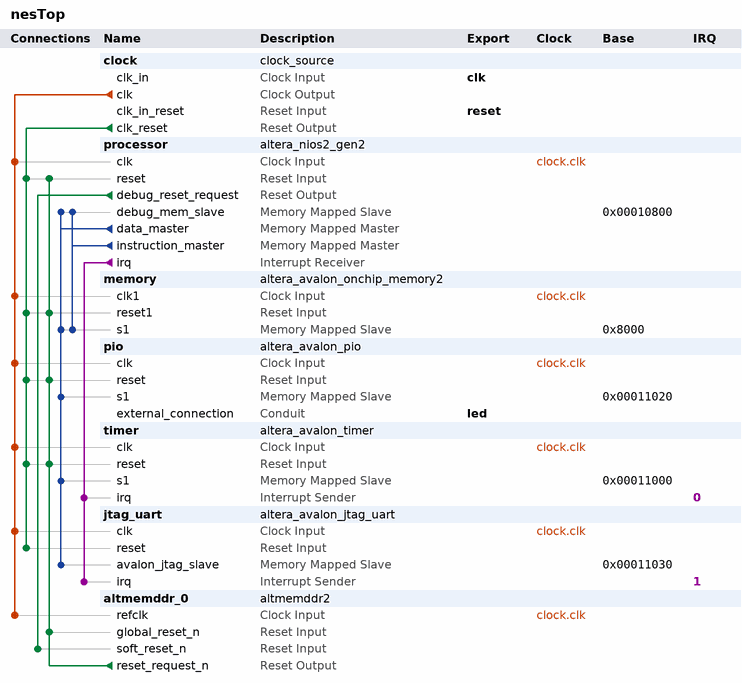
[diagram p0: system contents]
# Platform Designer (Qsys) system nesTop, Cyclone IV E EP4CE22F17C6
# Parameters at their usual value, and those the tool derives, are not listed.
package require -exact qsys 16.1
create_system nesTop
set_project_property DEVICE_FAMILY {Cyclone IV E}
set_project_property DEVICE EP4CE22F17C6

add_instance clock clock_source 16.1
set_instance_parameter_value clock clockFrequency 100000000

add_instance processor altera_nios2_gen2 16.1
set_instance_parameter_value processor dcache_size 2048
set_instance_parameter_value processor exceptionSlave memory.s1
set_instance_parameter_value processor icache_size 4096
set_instance_parameter_value processor impl Tiny
set_instance_parameter_value processor resetSlave memory.s1

add_instance memory altera_avalon_onchip_memory2 16.1
set_instance_parameter_value memory dataWidth 32
set_instance_parameter_value memory dualPort false
set_instance_parameter_value memory initMemContent true
set_instance_parameter_value memory initializationFileName onchip_mem.hex
set_instance_parameter_value memory memorySize 32768

add_instance pio altera_avalon_pio 16.1
set_instance_parameter_value pio direction Output
set_instance_parameter_value pio width 8

add_instance timer altera_avalon_timer 16.1
set_instance_parameter_value timer period 1
set_instance_parameter_value timer periodUnits MSEC

add_instance jtag_uart altera_avalon_jtag_uart 16.1
set_instance_parameter_value jtag_uart simInteractiveOptions NO_INTERACTIVE_WINDOWS

add_instance altmemddr_0 altmemddr2 16.1
set_instance_parameter_value altmemddr_0 WIDTH_RATIO 4
set_instance_parameter_value altmemddr_0 ac_clk_select 90
set_instance_parameter_value altmemddr_0 ac_phase 90
set_instance_parameter_value altmemddr_0 addr_cmd_slew_rate 1.0
set_instance_parameter_value altmemddr_0 auto_powerdn_cycles 0
set_instance_parameter_value altmemddr_0 auto_powerdn_en false
set_instance_parameter_value altmemddr_0 avalon_burst_length 1
set_instance_parameter_value altmemddr_0 board_addresscmd_CK_skew 0.0
set_instance_parameter_value altmemddr_0 board_inter_DQS_group_skew 0.02
set_instance_parameter_value altmemddr_0 board_intra_DQS_group_skew 0.02
set_instance_parameter_value altmemddr_0 board_maxCK_DQS_skew 0.01
set_instance_parameter_value altmemddr_0 board_minCK_DQS_skew -0.01
set_instance_parameter_value altmemddr_0 board_settings_valid true
set_instance_parameter_value altmemddr_0 board_skew_ps 20
set_instance_parameter_value altmemddr_0 board_tpd_inter_DIMM 0.05
set_instance_parameter_value altmemddr_0 burst_merge_en false
set_instance_parameter_value altmemddr_0 cfg_data_reordering_type INTER_BANK
set_instance_parameter_value altmemddr_0 cfg_reorder_data true
set_instance_parameter_value altmemddr_0 cfg_starve_limit 10
set_instance_parameter_value altmemddr_0 chip_or_dimm {Discrete Device}
set_instance_parameter_value altmemddr_0 ck_ckn_slew_rate 2.0
set_instance_parameter_value altmemddr_0 clk_source_sharing_en false
set_instance_parameter_value altmemddr_0 controller_type ngv110_ctl
set_instance_parameter_value altmemddr_0 csr_en false
set_instance_parameter_value altmemddr_0 ctl_auto_correct_en false
set_instance_parameter_value altmemddr_0 ctl_autopch_en false
set_instance_parameter_value altmemddr_0 ctl_dynamic_bank_allocation false
set_instance_parameter_value altmemddr_0 ctl_dynamic_bank_num 4
set_instance_parameter_value altmemddr_0 ctl_ecc_en false
set_instance_parameter_value altmemddr_0 ctl_hrb_en false
set_instance_parameter_value altmemddr_0 ctl_latency 0
set_instance_parameter_value altmemddr_0 ctl_lookahead_depth 4
set_instance_parameter_value altmemddr_0 ctl_powerdn_en false
set_instance_parameter_value altmemddr_0 ctl_self_refresh_en false
set_instance_parameter_value altmemddr_0 debug_en false
set_instance_parameter_value altmemddr_0 dedicated_memory_clk_en false
set_instance_parameter_value altmemddr_0 dedicated_memory_clk_phase 0
set_instance_parameter_value altmemddr_0 dedicated_memory_clk_phase_label {Dedicated memory clock phase:}
set_instance_parameter_value altmemddr_0 dll_external false
set_instance_parameter_value altmemddr_0 dq_slew_rate 1.0
set_instance_parameter_value altmemddr_0 dqs_dqsn_slew_rate 2.0
set_instance_parameter_value altmemddr_0 dss_tinit_rst_us 200.0
set_instance_parameter_value altmemddr_0 enable_mp_calibration true
set_instance_parameter_value altmemddr_0 enable_v72_rsu false
set_instance_parameter_value altmemddr_0 export_bank_info false
set_instance_parameter_value altmemddr_0 export_debug_port false
set_instance_parameter_value altmemddr_0 family {Cyclone IV E}
set_instance_parameter_value altmemddr_0 fast_simulation_en FAST
set_instance_parameter_value altmemddr_0 input_period 0
set_instance_parameter_value altmemddr_0 isi_DQ 0.0
set_instance_parameter_value altmemddr_0 isi_DQS 0.0
set_instance_parameter_value altmemddr_0 isi_addresscmd_hold 0.0
set_instance_parameter_value altmemddr_0 isi_addresscmd_setup 0.0
set_instance_parameter_value altmemddr_0 local_if_clk_mhz_label 200.0
set_instance_parameter_value altmemddr_0 local_if_drate Full
set_instance_parameter_value altmemddr_0 local_if_dwidth_label 16
set_instance_parameter_value altmemddr_0 local_if_type_avalon true
set_instance_parameter_value altmemddr_0 max_local_size 4
set_instance_parameter_value altmemddr_0 mem_addr_mapping CHIP_ROW_BANK_COL
set_instance_parameter_value altmemddr_0 mem_asrm {Manual SR Reference (SRT)}
set_instance_parameter_value altmemddr_0 mem_atcl Disabled
set_instance_parameter_value altmemddr_0 mem_bl 4
set_instance_parameter_value altmemddr_0 mem_btype Sequential
set_instance_parameter_value altmemddr_0 mem_dll_en Yes
set_instance_parameter_value altmemddr_0 mem_dll_pch {Fast Exit}
set_instance_parameter_value altmemddr_0 mem_drv_impedance RZQ/7
set_instance_parameter_value altmemddr_0 mem_drv_str Normal
set_instance_parameter_value altmemddr_0 mem_dyn_deskew_en false
set_instance_parameter_value altmemddr_0 mem_fmax 200.0
set_instance_parameter_value altmemddr_0 mem_if_bankaddr_width 2
set_instance_parameter_value altmemddr_0 mem_if_clk_mhz 200.0
set_instance_parameter_value altmemddr_0 mem_if_clk_pair_count 1
set_instance_parameter_value altmemddr_0 mem_if_clk_ps_label {(5000 ps)}
set_instance_parameter_value altmemddr_0 mem_if_coladdr_width 10
set_instance_parameter_value altmemddr_0 mem_if_cs_per_dimm 1
set_instance_parameter_value altmemddr_0 mem_if_cs_per_rank 1
set_instance_parameter_value altmemddr_0 mem_if_cs_width 1
set_instance_parameter_value altmemddr_0 mem_if_dm_pins_en Yes
set_instance_parameter_value altmemddr_0 mem_if_dq_per_dqs 8
set_instance_parameter_value altmemddr_0 mem_if_dqsn_en false
set_instance_parameter_value altmemddr_0 mem_if_dwidth 8
set_instance_parameter_value altmemddr_0 mem_if_memtype {DDR2 SDRAM}
set_instance_parameter_value altmemddr_0 mem_if_oct_en false
set_instance_parameter_value altmemddr_0 mem_if_pchaddr_bit 10
set_instance_parameter_value altmemddr_0 mem_if_preset {JEDEC DDR2-400 256Mb x8}
set_instance_parameter_value altmemddr_0 mem_if_preset_rlat 0
set_instance_parameter_value altmemddr_0 mem_if_rowaddr_width 13
set_instance_parameter_value altmemddr_0 mem_if_tinit_us 200.0
set_instance_parameter_value altmemddr_0 mem_if_tmrd_ns 10.0
set_instance_parameter_value altmemddr_0 mem_if_tras_ns 40.0
set_instance_parameter_value altmemddr_0 mem_if_trcd_ns 15.0
set_instance_parameter_value altmemddr_0 mem_if_trefi_us 7.0
set_instance_parameter_value altmemddr_0 mem_if_trfc_ns 75.0
set_instance_parameter_value altmemddr_0 mem_if_trp_ns 15.0
set_instance_parameter_value altmemddr_0 mem_if_twr_ns 15.0
set_instance_parameter_value altmemddr_0 mem_if_twtr_ck 2
set_instance_parameter_value altmemddr_0 mem_mpr_loc {Predefined Pattern}
set_instance_parameter_value altmemddr_0 mem_mpr_oper {Predefined Pattern}
set_instance_parameter_value altmemddr_0 mem_odt Disabled
set_instance_parameter_value altmemddr_0 mem_pasr {Full Array}
set_instance_parameter_value altmemddr_0 mem_rtt_nom {ODT Disabled}
set_instance_parameter_value altmemddr_0 mem_rtt_wr {Dynamic ODT off}
set_instance_parameter_value altmemddr_0 mem_srtr Normal
set_instance_parameter_value altmemddr_0 mem_tac_ps 600
set_instance_parameter_value altmemddr_0 mem_tcl 3.0
set_instance_parameter_value altmemddr_0 mem_tcl_100_fmax 400.0
set_instance_parameter_value altmemddr_0 mem_tcl_15_fmax 533.0
set_instance_parameter_value altmemddr_0 mem_tcl_20_fmax 533.0
set_instance_parameter_value altmemddr_0 mem_tcl_25_fmax 533.0
set_instance_parameter_value altmemddr_0 mem_tcl_30_fmax 200.0
set_instance_parameter_value altmemddr_0 mem_tcl_40_fmax 200.0
set_instance_parameter_value altmemddr_0 mem_tcl_50_fmax 200.0
set_instance_parameter_value altmemddr_0 mem_tcl_60_fmax 200.0
set_instance_parameter_value altmemddr_0 mem_tcl_70_fmax 400.0
set_instance_parameter_value altmemddr_0 mem_tcl_80_fmax 400.0
set_instance_parameter_value altmemddr_0 mem_tcl_90_fmax 400.0
set_instance_parameter_value altmemddr_0 mem_tdha_ps 400
set_instance_parameter_value altmemddr_0 mem_tdqsck_ps 500
set_instance_parameter_value altmemddr_0 mem_tdqsq_ps 400
set_instance_parameter_value altmemddr_0 mem_tdqss_ck 0.25
set_instance_parameter_value altmemddr_0 mem_tdsa_ps 400
set_instance_parameter_value altmemddr_0 mem_tdsh_ck 0.2
set_instance_parameter_value altmemddr_0 mem_tdss_ck 0.2
set_instance_parameter_value altmemddr_0 mem_tfaw_ns 37.5
set_instance_parameter_value altmemddr_0 mem_tiha_ps 600
set_instance_parameter_value altmemddr_0 mem_tisa_ps 600
set_instance_parameter_value altmemddr_0 mem_tqh_ck 0.36
set_instance_parameter_value altmemddr_0 mem_tqhs_ps 450
set_instance_parameter_value altmemddr_0 mem_trrd_ns 7.5
set_instance_parameter_value altmemddr_0 mem_trtp_ns 7.5
set_instance_parameter_value altmemddr_0 mem_wtcl 5.0
set_instance_parameter_value altmemddr_0 mirror_addressing 0
set_instance_parameter_value altmemddr_0 mp_DH_percent 0.5
set_instance_parameter_value altmemddr_0 mp_DQSCK_percent 0.5
set_instance_parameter_value altmemddr_0 mp_DQSQ_percent 0.65
set_instance_parameter_value altmemddr_0 mp_DQSS_percent 0.5
set_instance_parameter_value altmemddr_0 mp_DSH_percent 0.6
set_instance_parameter_value altmemddr_0 mp_DSS_percent 0.6
set_instance_parameter_value altmemddr_0 mp_DS_percent 0.6
set_instance_parameter_value altmemddr_0 mp_IH_percent 0.6
set_instance_parameter_value altmemddr_0 mp_IS_percent 0.7
set_instance_parameter_value altmemddr_0 mp_QHS_percent 0.5
set_instance_parameter_value altmemddr_0 mp_QH_percent 0.5
set_instance_parameter_value altmemddr_0 mp_WLH_percent 0.6
set_instance_parameter_value altmemddr_0 mp_WLS_percent 0.7
set_instance_parameter_value altmemddr_0 multicast_wr_en false
set_instance_parameter_value altmemddr_0 new_variant true
set_instance_parameter_value altmemddr_0 num_slots_or_devices 1
set_instance_parameter_value altmemddr_0 phy_if_type_afi true
set_instance_parameter_value altmemddr_0 pipeline_commands false
set_instance_parameter_value altmemddr_0 pll_reconfig_ports_en false
set_instance_parameter_value altmemddr_0 pll_ref_clk_mhz 100.0
set_instance_parameter_value altmemddr_0 pll_ref_clk_ps_label {(10000 ps)}
set_instance_parameter_value altmemddr_0 post_latency_label {cycles (0 cycles=minimum latency, non-deterministic)}
set_instance_parameter_value altmemddr_0 pre_latency_label {Fix read latency at:}
set_instance_parameter_value altmemddr_0 project_family {Cyclone IV E}
set_instance_parameter_value altmemddr_0 qsys_mode true
set_instance_parameter_value altmemddr_0 quartus_project_exists false
set_instance_parameter_value altmemddr_0 ref_clk_source clock
set_instance_parameter_value altmemddr_0 register_control_word_0 0000
set_instance_parameter_value altmemddr_0 register_control_word_1 0000
set_instance_parameter_value altmemddr_0 register_control_word_10 0000
set_instance_parameter_value altmemddr_0 register_control_word_11 0000
set_instance_parameter_value altmemddr_0 register_control_word_12 0000
set_instance_parameter_value altmemddr_0 register_control_word_13 0000
set_instance_parameter_value altmemddr_0 register_control_word_14 0000
set_instance_parameter_value altmemddr_0 register_control_word_15 0000
set_instance_parameter_value altmemddr_0 register_control_word_2 0000
set_instance_parameter_value altmemddr_0 register_control_word_3 0000
set_instance_parameter_value altmemddr_0 register_control_word_4 0000
set_instance_parameter_value altmemddr_0 register_control_word_5 0000
set_instance_parameter_value altmemddr_0 register_control_word_6 0000
set_instance_parameter_value altmemddr_0 register_control_word_7 0000
set_instance_parameter_value altmemddr_0 register_control_word_8 0000
set_instance_parameter_value altmemddr_0 register_control_word_9 0000
set_instance_parameter_value altmemddr_0 register_control_word_size 4
set_instance_parameter_value altmemddr_0 restore_default_toggle false
set_instance_parameter_value altmemddr_0 speed_grade 6
set_instance_parameter_value altmemddr_0 t_DH 0.4
set_instance_parameter_value altmemddr_0 t_DH_calculated 0.400
set_instance_parameter_value altmemddr_0 t_DS 0.4
set_instance_parameter_value altmemddr_0 t_DS_calculated 0.400
set_instance_parameter_value altmemddr_0 t_IH 0.6
set_instance_parameter_value altmemddr_0 t_IH_calculated 0.600
set_instance_parameter_value altmemddr_0 t_IS 0.6
set_instance_parameter_value altmemddr_0 t_IS_calculated 0.600
set_instance_parameter_value altmemddr_0 tool_context SOPC_BUILDER
set_instance_parameter_value altmemddr_0 use_generated_memory_model true
set_instance_parameter_value altmemddr_0 user_refresh_en false
set_instance_parameter_value altmemddr_0 vendor JEDEC

# connections
add_connection clock.clk altmemddr_0.refclk clock
add_connection clock.clk jtag_uart.clk clock
add_connection clock.clk memory.clk1 clock
add_connection clock.clk pio.clk clock
add_connection clock.clk processor.clk clock
add_connection clock.clk timer.clk clock
add_connection altmemddr_0.reset_request_n altmemddr_0.global_reset_n reset
add_connection altmemddr_0.reset_request_n memory.reset1 reset
add_connection altmemddr_0.reset_request_n pio.reset reset
add_connection altmemddr_0.reset_request_n processor.reset reset
add_connection altmemddr_0.reset_request_n timer.reset reset
add_connection clock.clk_reset jtag_uart.reset reset
add_connection clock.clk_reset memory.reset1 reset
add_connection clock.clk_reset pio.reset reset
add_connection clock.clk_reset processor.reset reset
add_connection clock.clk_reset timer.reset reset
add_connection processor.debug_reset_request altmemddr_0.soft_reset_n reset
add_connection processor.data_master jtag_uart.avalon_jtag_slave avalon
set_connection_parameter_value processor.data_master/jtag_uart.avalon_jtag_slave baseAddress 0x00011030
add_connection processor.data_master memory.s1 avalon
set_connection_parameter_value processor.data_master/memory.s1 baseAddress 0x8000
add_connection processor.data_master pio.s1 avalon
set_connection_parameter_value processor.data_master/pio.s1 baseAddress 0x00011020
add_connection processor.data_master processor.debug_mem_slave avalon
set_connection_parameter_value processor.data_master/processor.debug_mem_slave baseAddress 0x00010800
add_connection processor.data_master timer.s1 avalon
set_connection_parameter_value processor.data_master/timer.s1 baseAddress 0x00011000
add_connection processor.instruction_master memory.s1 avalon
set_connection_parameter_value processor.instruction_master/memory.s1 baseAddress 0x8000
add_connection processor.instruction_master processor.debug_mem_slave avalon
set_connection_parameter_value processor.instruction_master/processor.debug_mem_slave baseAddress 0x00010800
add_connection processor.irq jtag_uart.irq interrupt
set_connection_parameter_value processor.irq/jtag_uart.irq irqNumber 1
add_connection processor.irq timer.irq interrupt
set_connection_parameter_value processor.irq/timer.irq irqNumber 0

# exported interfaces
add_interface clk clock sink
set_interface_property clk EXPORT_OF clock.clk_in
add_interface led conduit end
set_interface_property led EXPORT_OF pio.external_connection
add_interface reset reset sink
set_interface_property reset EXPORT_OF clock.clk_in_reset

set_interconnect_requirement {$system} qsys_mm.clockCrossingAdapter HANDSHAKE
set_interconnect_requirement {$system} qsys_mm.enableEccProtection FALSE
set_interconnect_requirement {$system} qsys_mm.insertDefaultSlave FALSE
set_interconnect_requirement {$system} qsys_mm.maxAdditionalLatency 1

save_system nesTop.qsys
